# Altium schematic sheet farbBorg.SchDoc: Farb-Borg-3d / AVR und CPLD
size A4
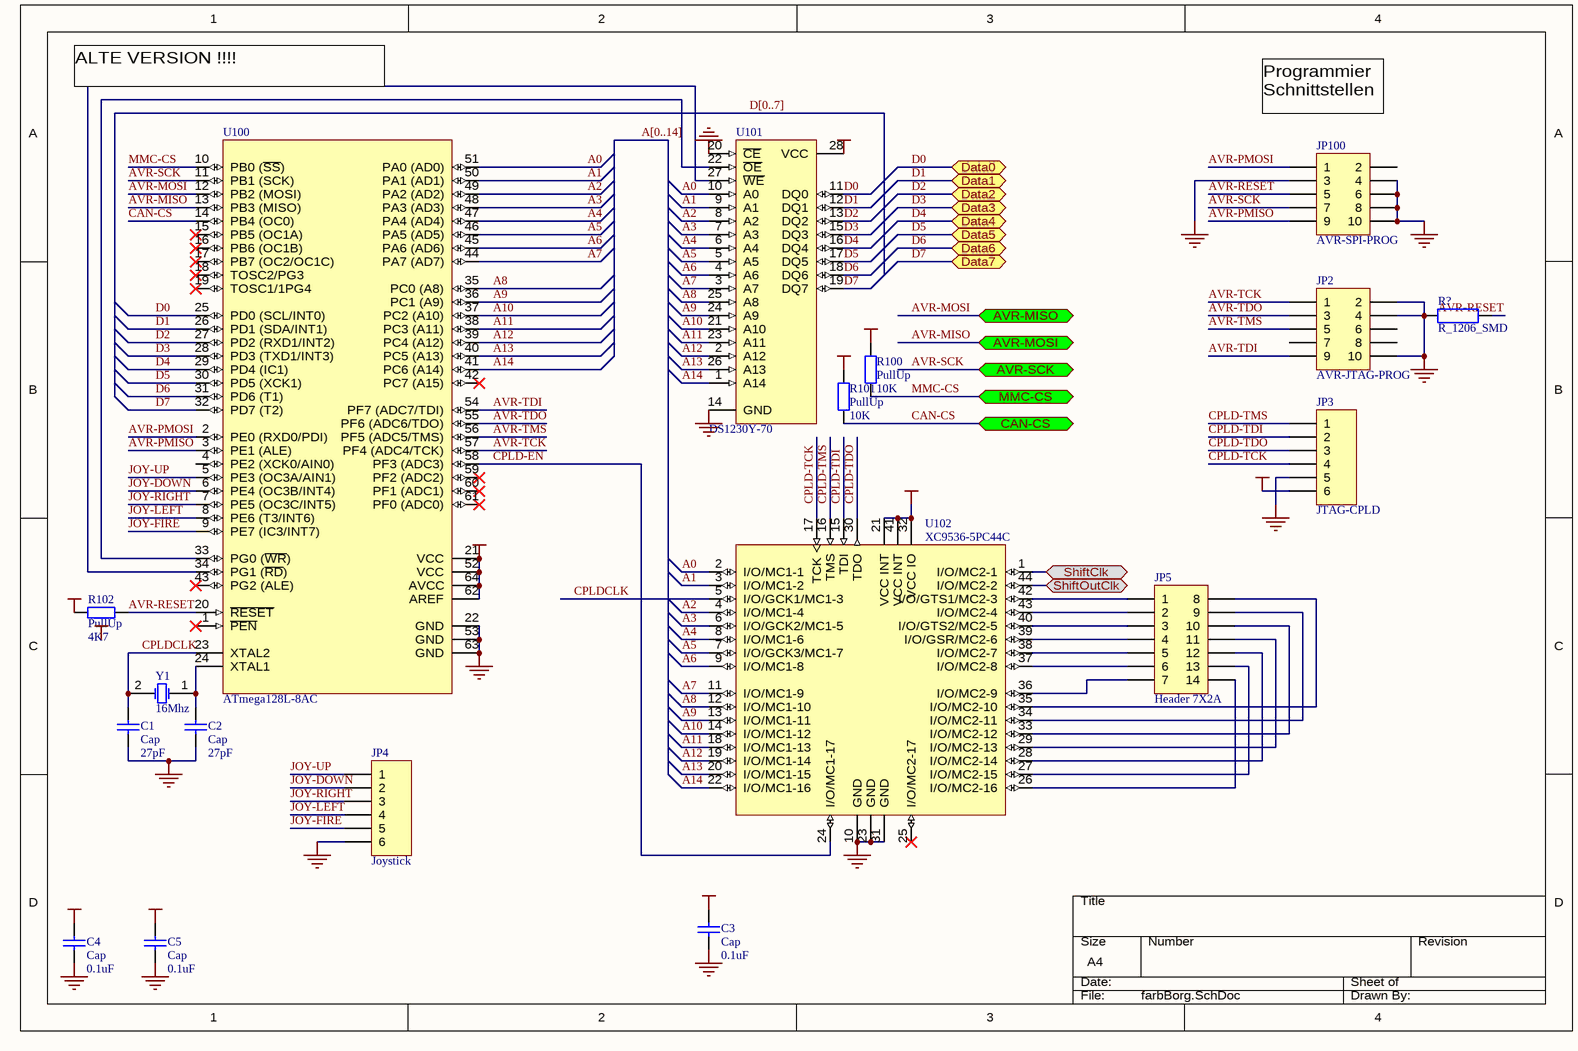
[diagram p0: farbBorg.SchDoc]

## Parts
C1  Cap  value 27pF  [RAD-0.3]
C2  Cap  value 27pF  [RAD-0.3]
C3  Cap  value 0.1uF  [RAD-0.3]
C4  Cap  value 0.1uF  [RAD-0.3]
C5  Cap  value 0.1uF  [RAD-0.3]
JP2  AVR-JTAG-PROG  [HDR2X5]
JP3  JTAG-CPLD  [HDR1X6]
JP4  Joystick  [HDR1X6]
JP5  Header 7X2A  [HDR2X7_CEN]
JP100  AVR-SPI-PROG  [HDR2X5]
R100  PullUp  value 10K  [CR2012-0805]
R101  PullUp  value 10K  [CR2012-0805]
R102  PullUp  value 4K7  [CR2012-0805]
R?  R_1206_SMD  [1206_R]
U100  ATmega128L-8AC  [64A]
U101  DS1230Y-70  [ENDIP28A]
U102  XC9536-5PC44C  [PC44]
Y1  16Mhz  [BCY-W2/D3.1]

## Ports
AVR-MISO (bidir), AVR-MOSI (bidir), AVR-SCK (bidir), CAN-CS (bidir), Data0 (bidir), Data1 (bidir), Data2 (bidir), Data3 (bidir), Data4 (bidir), Data5 (bidir), Data6 (bidir), Data7 (bidir), MMC-CS (bidir), ShiftClk (bidir), ShiftOutClk (bidir)

## Nets
GND: C1.2 C2.1 C3.1 C4.1 C5.1 JP2.2 JP2.4 JP2.10 JP3.5 JP4.6 JP100.3 JP100.4 JP100.6 JP100.8 JP100.10 R?.1 U100.22(GND) U100.53(GND) U100.63(GND) U101.14(GND) U101.20(~{CE}) U102.10(GND) U102.23(GND) U102.31(GND)
VCC: C3.2 C4.2 C5.2 JP3.6 R100.2 R101.2 R102.1 U100.21(VCC) U100.52(VCC) U100.62(AREF) U100.64(AVCC) U101.28(VCC) U102.21(VCC_INT) U102.32(VCC_IO) U102.41(VCC_INT)
A0: U100.51(PA0_(AD0)) U101.10(A0) U102.2(I/O/MC1-1)
A1: U100.50(PA1_(AD1)) U101.9(A1) U102.3(I/O/MC1-2)
A2: U100.49(PA2_(AD2)) U101.8(A2) U102.4(I/O/MC1-4)
A3: U100.48(PA3_(AD3)) U101.7(A3) U102.6(I/O/GCK2/MC1-5)
A4: U100.47(PA4_(AD4)) U101.6(A4) U102.8(I/O/MC1-6)
A5: U100.46(PA5_(AD5)) U101.5(A5) U102.7(I/O/GCK3/MC1-7)
A6: U100.45(PA6_(AD6)) U101.4(A6) U102.9(I/O/MC1-8)
A7: U100.44(PA7_(AD7)) U101.3(A7) U102.11(I/O/MC1-9)
A8: U100.35(PC0_(A8)) U101.25(A8) U102.12(I/O/MC1-10)
A9: U100.36(PC1_(A9)) U101.24(A9) U102.13(I/O/MC1-11)
A10: U100.37(PC2_(A10)) U101.21(A10) U102.14(I/O/MC1-12)
A11: U100.38(PC3_(A11)) U101.23(A11) U102.18(I/O/MC1-13)
A12: U100.39(PC4_(A12)) U101.2(A12) U102.19(I/O/MC1-14)
A13: U100.40(PC5_(A13)) U101.26(A13) U102.20(I/O/MC1-15)
A14: U100.41(PC6_(A14)) U101.1(A14) U102.22(I/O/MC1-16)
AVR-MISO: U100.13(PB3_(MISO)) ; port AVR-MOSI
AVR-MOSI: U100.12(PB2_(MOSI)) ; port AVR-MISO
AVR-PMISO: JP100.9 U100.3(PE1_(ALE))
AVR-PMOSI: JP100.1 U100.2(PE0_(RXD0/PDI))
AVR-RESET: JP100.5 R102.2 U100.20(~{RESET})
AVR-SCK: JP100.7 U100.11(PB1_(SCK)) ; port AVR-SCK
AVR-TCK: JP2.1 U100.57(PF4_(ADC4/TCK))
AVR-TDI: JP2.9 U100.54(PF7_(ADC7/TDI))
AVR-TDO: JP2.3 U100.55(PF6_(ADC6/TDO))
AVR-TMS: JP2.5 U100.56(PF5_(ADC5/TMS))
CAN-CS: R101.1 U100.14(PB4_(OC0)) ; port CAN-CS
CPLD-EN: U100.58(PF3_(ADC3)) U102.24(I/O/MC1-17)
CPLD-TCK: JP3.4 U102.17(TCK)
CPLD-TDI: JP3.2 U102.15(TDI)
CPLD-TDO: JP3.3 U102.30(TDO)
CPLD-TMS: JP3.1 U102.16(TMS)
CPLDCLK: C1.1 U100.23(XTAL2) U102.5(I/O/GCK1/MC1-3) Y1.2(OSC2)
D0: U100.25(PD0_(SCL/INT0)) U101.11(DQ0) ; port Data0
D1: U100.26(PD1_(SDA/INT1)) U101.12(DQ1) ; port Data1
D2: U100.27(PD2_(RXD1/INT2)) U101.13(DQ2) ; port Data2
D3: U100.28(PD3_(TXD1/INT3)) U101.15(DQ3) ; port Data3
D4: U100.29(PD4_(IC1)) U101.16(DQ4) ; port Data4
D5: U100.30(PD5_(XCK1)) U101.17(DQ5) ; port Data5
D6: U100.31(PD6_(T1)) U101.18(DQ6) ; port Data6
D7: U100.32(PD7_(T2)) U101.19(DQ7) ; port Data7
JOY-DOWN: JP4.2 U100.6(PE4_(OC3B/INT4))
JOY-FIRE: JP4.5 U100.9(PE7_(IC3/INT7))
JOY-LEFT: JP4.4 U100.8(PE6_(T3/INT6))
JOY-RIGHT: JP4.3 U100.7(PE5_(OC3C/INT5))
JOY-UP: JP4.1 U100.5(PE3_(OC3A/AIN1))
MMC-CS: R100.1 U100.10(PB0_(~{SS})) ; port MMC-CS
ShiftClk: U102.1(I/O/MC2-1) ; port ShiftClk
ShiftOutClk: U102.44(I/O/MC2-2) ; port ShiftOutClk
NetC2_2: C2.2 U100.24(XTAL1) Y1.1(OSC1)
NetJP5_1: JP5.1 U102.42(I/O/GTS1/MC2-3)
NetJP5_2: JP5.2 U102.43(I/O/MC2-4)
NetJP5_3: JP5.3 U102.40(I/O/GTS2/MC2-5)
NetJP5_4: JP5.4 U102.39(I/O/GSR/MC2-6)
NetJP5_5: JP5.5 U102.38(I/O/MC2-7)
NetJP5_6: JP5.6 U102.37(I/O/MC2-8)
NetJP5_7: JP5.7 U102.36(I/O/MC2-9)
NetJP5_8: JP5.8 U102.35(I/O/MC2-10)
NetJP5_9: JP5.9 U102.34(I/O/MC2-11)
NetJP5_10: JP5.10 U102.33(I/O/MC2-12)
NetJP5_11: JP5.11 U102.29(I/O/MC2-13)
NetJP5_12: JP5.12 U102.28(I/O/MC2-14)
NetJP5_13: JP5.13 U102.27(I/O/MC2-15)
NetJP5_14: JP5.14 U102.26(I/O/MC2-16)
NetU100_33: U100.33(PG0_(~{WR})) U101.22(~{OE})
NetU100_34: U100.34(PG1_(~{RD})) U101.27(~{WE})

Not connected (* = marked no-connect by the designer): JP2 6 7 8; JP100 2; R? 2; U100 1(~{PEN})* 4(PE2_(XCK0/AIN0)) 15(PB5_(OC1A))* 16(PB6_(OC1B))* 17(PB7_(OC2/OC1C))* 18(TOSC2/PG3)* 19(TOSC1/1PG4)* 42(PC7_(A15))* 43(PG2_(ALE))* 59(PF2_(ADC2))* 60(PF1_(ADC1))* 61(PF0_(ADC0))*; U102 25(I/O/MC2-17)*

## Buses and harness runs
bus A[0..14]
bus D[0..7]

## Notes on the sheet
- ALTE VERSION !!!!
- Programmier
  Schnittstellen
- Labels drawn without touching a wire or pin: AVR-RESET, VCC

## Library data of the parts
C1-C5 = Cap: Capacitor; Published: 8-Jun-2000; Revision: July-2002: Re-released for DXP Platform.; Publisher: Altium Limited
JP2 JP100 = Header 5X2: Header, 5-Pin, Dual row; Revision: 17-Jul-2002: Re-released for DXP Platform.; Publisher: Altium Limited
JP3 JP4 = Header 6: Header, 6-Pin; Revision: 17-Jul-2002: Re-released for DXP Platform.; Publisher: Altium Limited
JP5 = Header 7X2A: Header, 7-Pin, Dual row; Revision: 17-Jul-2002: Re-released for DXP Platform.; Publisher: Altium Limited
R100-R102 = Res2: Resistor; Published: 8-Jun-2000; Revision: July-2002: Re-released for DXP Platform.; Publisher: Altium Limited
R? = R_1206_SMD: Widerstand
U100 = ATmega128L-8AC: 8-Bit AVR Microcontroller with 128K Bytes of In-System Programmable Flash Memory; Package Information: Latest Revision: revB, Oct-2001; Code - JEDEC: MS-026-AEB; Published: 17-Sep-2003; Datasheet: Latest Revision: 2467G-AVR-09/02; Package Reference: 64A; Publisher: Altium Limited
U101 = DS1230Y-70: 256K Nonvolatile SRAM; Published: 13-Oct-2000; Revision: 17-Jul-2002: PCB footprint, 'DIP-P28/X1.2' replaced; Re-released for DXP Platform.; Datasheet: Latest Revision: 23-Apr-1998; Package Reference: ENDIP28A; Publisher: Altium Limited
U102 = XC9536-5PC44C: XC9500 CPLD with 36 Macrocells, 44-Pin PLCC, Commercial Grade; Revision 1: 17-Jul-2002: Re-released for DXP Platform.; Revision 2: 17-Sep-2003: PCB Footprint dimensions updated; Package Information: Latest Revision: ver1.0, Jun-2000; Code - JEDEC: MS-047; Code - IPC: PLCC-44; Published: 8-Jun-2000; Datasheet: Latest Revision: ver6.1, Aug-2003; Package Reference: PC44; Publisher: Altium Limited
Y1 = XTAL: Crystal Oscillator; Published: 8-Jun-2000; Revision: July-2002: Re-released for DXP Platform.; Publisher: Altium Limited